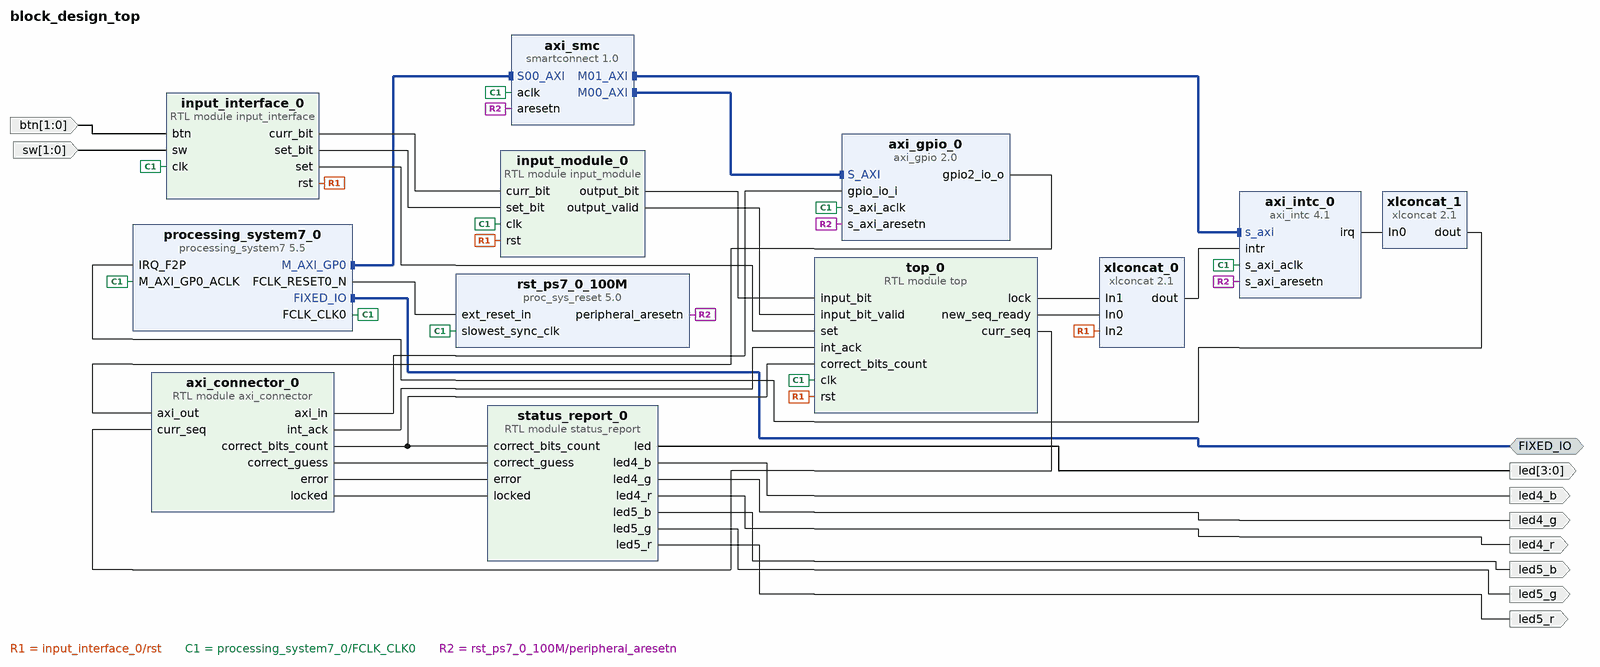
[diagram p0: block diagram of the top level]
# Vivado block design block_design_top, xc7z020clg400-1, Vivado 2022.2
create_bd_design block_design_top

create_bd_intf_port -mode Master -vlnv xilinx.com:display_processing_system7:fixedio_rtl:1.0 FIXED_IO
create_bd_port -dir I -from 1 -to 0 sw
create_bd_port -dir I -from 1 -to 0 btn
create_bd_port -dir O led4_b
create_bd_port -dir O -from 3 -to 0 led
create_bd_port -dir O led5_b
create_bd_port -dir O led4_r
create_bd_port -dir O led5_r
create_bd_port -dir O led4_g
create_bd_port -dir O led5_g

create_bd_cell -type ip -vlnv xilinx.com:ip:processing_system7:5.5 processing_system7_0
set_property -dict [list \
  CONFIG.PCW_APU_PERIPHERAL_FREQMHZ 650 \
  CONFIG.PCW_CRYSTAL_PERIPHERAL_FREQMHZ 50 \
  CONFIG.PCW_ENET0_ENET0_IO {MIO 16 .. 27} \
  CONFIG.PCW_ENET0_GRP_MDIO_ENABLE 1 \
  CONFIG.PCW_ENET0_GRP_MDIO_IO {MIO 52 .. 53} \
  CONFIG.PCW_ENET0_PERIPHERAL_ENABLE 1 \
  CONFIG.PCW_FPGA0_PERIPHERAL_FREQMHZ 10 \
  CONFIG.PCW_FPGA1_PERIPHERAL_FREQMHZ 50 \
  CONFIG.PCW_GPIO_MIO_GPIO_ENABLE 0 \
  CONFIG.PCW_IRQ_F2P_INTR 1 \
  CONFIG.PCW_M_AXI_GP0_FREQMHZ 10 \
  CONFIG.PCW_PERIPHERAL_BOARD_PRESET part0 \
  CONFIG.PCW_PRESET_BANK1_VOLTAGE {LVCMOS 1.8V} \
  CONFIG.PCW_QSPI_GRP_FBCLK_ENABLE 1 \
  CONFIG.PCW_QSPI_GRP_FBCLK_IO {MIO 8} \
  CONFIG.PCW_QSPI_GRP_SINGLE_SS_ENABLE 1 \
  CONFIG.PCW_QSPI_GRP_SINGLE_SS_IO {MIO 1 .. 6} \
  CONFIG.PCW_QSPI_PERIPHERAL_ENABLE 1 \
  CONFIG.PCW_QSPI_QSPI_IO {MIO 1 .. 6} \
  CONFIG.PCW_SD0_GRP_CD_ENABLE 1 \
  CONFIG.PCW_SD0_GRP_CD_IO {MIO 47} \
  CONFIG.PCW_SD0_GRP_WP_ENABLE 0 \
  CONFIG.PCW_SD0_PERIPHERAL_ENABLE 1 \
  CONFIG.PCW_SD0_SD0_IO {MIO 40 .. 45} \
  CONFIG.PCW_SDIO_PERIPHERAL_FREQMHZ 50 \
  CONFIG.PCW_SINGLE_QSPI_DATA_MODE x4 \
  CONFIG.PCW_UART0_PERIPHERAL_ENABLE 1 \
  CONFIG.PCW_UART0_UART0_IO {MIO 14 .. 15} \
  CONFIG.PCW_UART1_PERIPHERAL_ENABLE 0 \
  CONFIG.PCW_UART_PERIPHERAL_FREQMHZ 100 \
  CONFIG.PCW_UIPARAM_DDR_ENABLE 0 \
  CONFIG.PCW_USB0_PERIPHERAL_ENABLE 0 \
  CONFIG.PCW_USE_FABRIC_INTERRUPT 1 \
  CONFIG.preset None \
] [get_bd_cells processing_system7_0]
# 409 more settings of processing_system7_0 are not shown: defaults, MIO pin electricals, DDR timing, and values the tool derives
create_bd_cell -type ip -vlnv xilinx.com:ip:axi_gpio:2.0 axi_gpio_0
set_property -dict [list \
  CONFIG.C_ALL_INPUTS 1 \
  CONFIG.C_ALL_OUTPUTS_2 1 \
  CONFIG.C_GPIO2_WIDTH 8 \
  CONFIG.C_GPIO_WIDTH 8 \
  CONFIG.C_IS_DUAL 1 \
  CONFIG.GPIO_BOARD_INTERFACE Custom \
  CONFIG.USE_BOARD_FLOW true \
] [get_bd_cells axi_gpio_0]
create_bd_cell -type ip -vlnv xilinx.com:ip:smartconnect:1.0 axi_smc
set_property -dict {CONFIG.NUM_MI 2 CONFIG.NUM_SI 1} [get_bd_cells axi_smc]
create_bd_cell -type ip -vlnv xilinx.com:ip:xlconcat:2.1 xlconcat_0
set_property -dict {CONFIG.NUM_PORTS 3} [get_bd_cells xlconcat_0]
create_bd_cell -type ip -vlnv xilinx.com:ip:axi_intc:4.1 axi_intc_0
set_property -dict [list \
  CONFIG.C_HAS_CIE 0 \
  CONFIG.C_HAS_IVR 0 \
  CONFIG.C_IRQ_CONNECTION 1 \
  CONFIG.C_KIND_OF_INTR 0xFFFFFFFF \
] [get_bd_cells axi_intc_0]
create_bd_cell -type ip -vlnv xilinx.com:ip:proc_sys_reset:5.0 rst_ps7_0_100M
create_bd_cell -type module -reference axi_connector axi_connector_0
create_bd_cell -type module -reference status_report status_report_0
create_bd_cell -type module -reference input_module input_module_0
create_bd_cell -type ip -vlnv xilinx.com:ip:xlconcat:2.1 xlconcat_1
set_property -dict {CONFIG.NUM_PORTS 1} [get_bd_cells xlconcat_1]
create_bd_cell -type module -reference input_interface input_interface_0
create_bd_cell -type module -reference top top_0

# ---- connections ----

connect_bd_intf_net [get_bd_intf_pins axi_smc/M00_AXI] [get_bd_intf_pins axi_gpio_0/S_AXI]
connect_bd_intf_net [get_bd_intf_pins axi_intc_0/s_axi] [get_bd_intf_pins axi_smc/M01_AXI]
connect_bd_intf_net [get_bd_intf_ports FIXED_IO] [get_bd_intf_pins processing_system7_0/FIXED_IO]
connect_bd_intf_net [get_bd_intf_pins processing_system7_0/M_AXI_GP0] [get_bd_intf_pins axi_smc/S00_AXI]
connect_bd_net [get_bd_pins axi_connector_0/correct_bits_count] \
  [get_bd_pins status_report_0/correct_bits_count] [get_bd_pins top_0/correct_bits_count]
connect_bd_net [get_bd_pins axi_connector_0/axi_in] [get_bd_pins axi_gpio_0/gpio_io_i]
connect_bd_net [get_bd_pins axi_connector_0/correct_guess] [get_bd_pins status_report_0/correct_guess]
connect_bd_net [get_bd_pins axi_connector_0/error] [get_bd_pins status_report_0/error]
connect_bd_net [get_bd_pins axi_connector_0/int_ack] [get_bd_pins top_0/int_ack]
connect_bd_net [get_bd_pins axi_connector_0/locked] [get_bd_pins status_report_0/locked]
connect_bd_net [get_bd_pins axi_gpio_0/gpio2_io_o] [get_bd_pins axi_connector_0/axi_out]
connect_bd_net [get_bd_pins axi_intc_0/irq] [get_bd_pins xlconcat_1/In0]
connect_bd_net [get_bd_ports btn] [get_bd_pins input_interface_0/btn]
connect_bd_net [get_bd_pins input_interface_0/curr_bit] [get_bd_pins input_module_0/curr_bit]
connect_bd_net [get_bd_pins input_interface_0/rst] [get_bd_pins xlconcat_0/In2] [get_bd_pins input_module_0/rst] [get_bd_pins top_0/rst]
connect_bd_net [get_bd_pins input_interface_0/set] [get_bd_pins top_0/set]
connect_bd_net [get_bd_pins input_interface_0/set_bit] [get_bd_pins input_module_0/set_bit]
connect_bd_net [get_bd_pins input_module_0/output_bit] [get_bd_pins top_0/input_bit]
connect_bd_net [get_bd_pins input_module_0/output_valid] [get_bd_pins top_0/input_bit_valid]
connect_bd_net [get_bd_pins processing_system7_0/FCLK_CLK0] \
  [get_bd_pins processing_system7_0/M_AXI_GP0_ACLK] [get_bd_pins axi_smc/aclk] [get_bd_pins axi_gpio_0/s_axi_aclk] \
  [get_bd_pins axi_intc_0/s_axi_aclk] [get_bd_pins rst_ps7_0_100M/slowest_sync_clk] [get_bd_pins input_module_0/clk] \
  [get_bd_pins input_interface_0/clk] [get_bd_pins top_0/clk]
connect_bd_net [get_bd_pins processing_system7_0/FCLK_RESET0_N] [get_bd_pins rst_ps7_0_100M/ext_reset_in]
connect_bd_net [get_bd_pins rst_ps7_0_100M/peripheral_aresetn] \
  [get_bd_pins axi_gpio_0/s_axi_aresetn] [get_bd_pins axi_smc/aresetn] [get_bd_pins axi_intc_0/s_axi_aresetn]
connect_bd_net [get_bd_pins status_report_0/led] [get_bd_ports led]
connect_bd_net [get_bd_pins status_report_0/led4_b] [get_bd_ports led4_b]
connect_bd_net [get_bd_pins status_report_0/led4_g] [get_bd_ports led4_g]
connect_bd_net [get_bd_pins status_report_0/led4_r] [get_bd_ports led4_r]
connect_bd_net [get_bd_pins status_report_0/led5_b] [get_bd_ports led5_b]
connect_bd_net [get_bd_pins status_report_0/led5_g] [get_bd_ports led5_g]
connect_bd_net [get_bd_pins status_report_0/led5_r] [get_bd_ports led5_r]
connect_bd_net [get_bd_ports sw] [get_bd_pins input_interface_0/sw]
connect_bd_net [get_bd_pins top_0/curr_seq] [get_bd_pins axi_connector_0/curr_seq]
connect_bd_net [get_bd_pins top_0/lock] [get_bd_pins xlconcat_0/In1]
connect_bd_net [get_bd_pins top_0/new_seq_ready] [get_bd_pins xlconcat_0/In0]
connect_bd_net [get_bd_pins xlconcat_0/dout] [get_bd_pins axi_intc_0/intr]
connect_bd_net [get_bd_pins xlconcat_1/dout] [get_bd_pins processing_system7_0/IRQ_F2P]

# ---- address map ----
assign_bd_address -offset 0x41200000 -range 64K -target_address_space [get_bd_addr_spaces processing_system7_0/Data] [get_bd_addr_segs axi_gpio_0/S_AXI/Reg]
assign_bd_address -offset 0x41800000 -range 64K -target_address_space [get_bd_addr_spaces processing_system7_0/Data] [get_bd_addr_segs axi_intc_0/S_AXI/Reg]

validate_bd_design
save_bd_design
